# Altium schematic sheet DSO_Power.SchDoc: Schematic_Name
size A4; CompanyName: University of Melbourne; Engineer: Your Name Here; DocumentNumber: 1; Revision: 0.1; SheetNumber: 1; SheetTotal: 1; Title_Project: Project_Title; StudentNo: Student No.
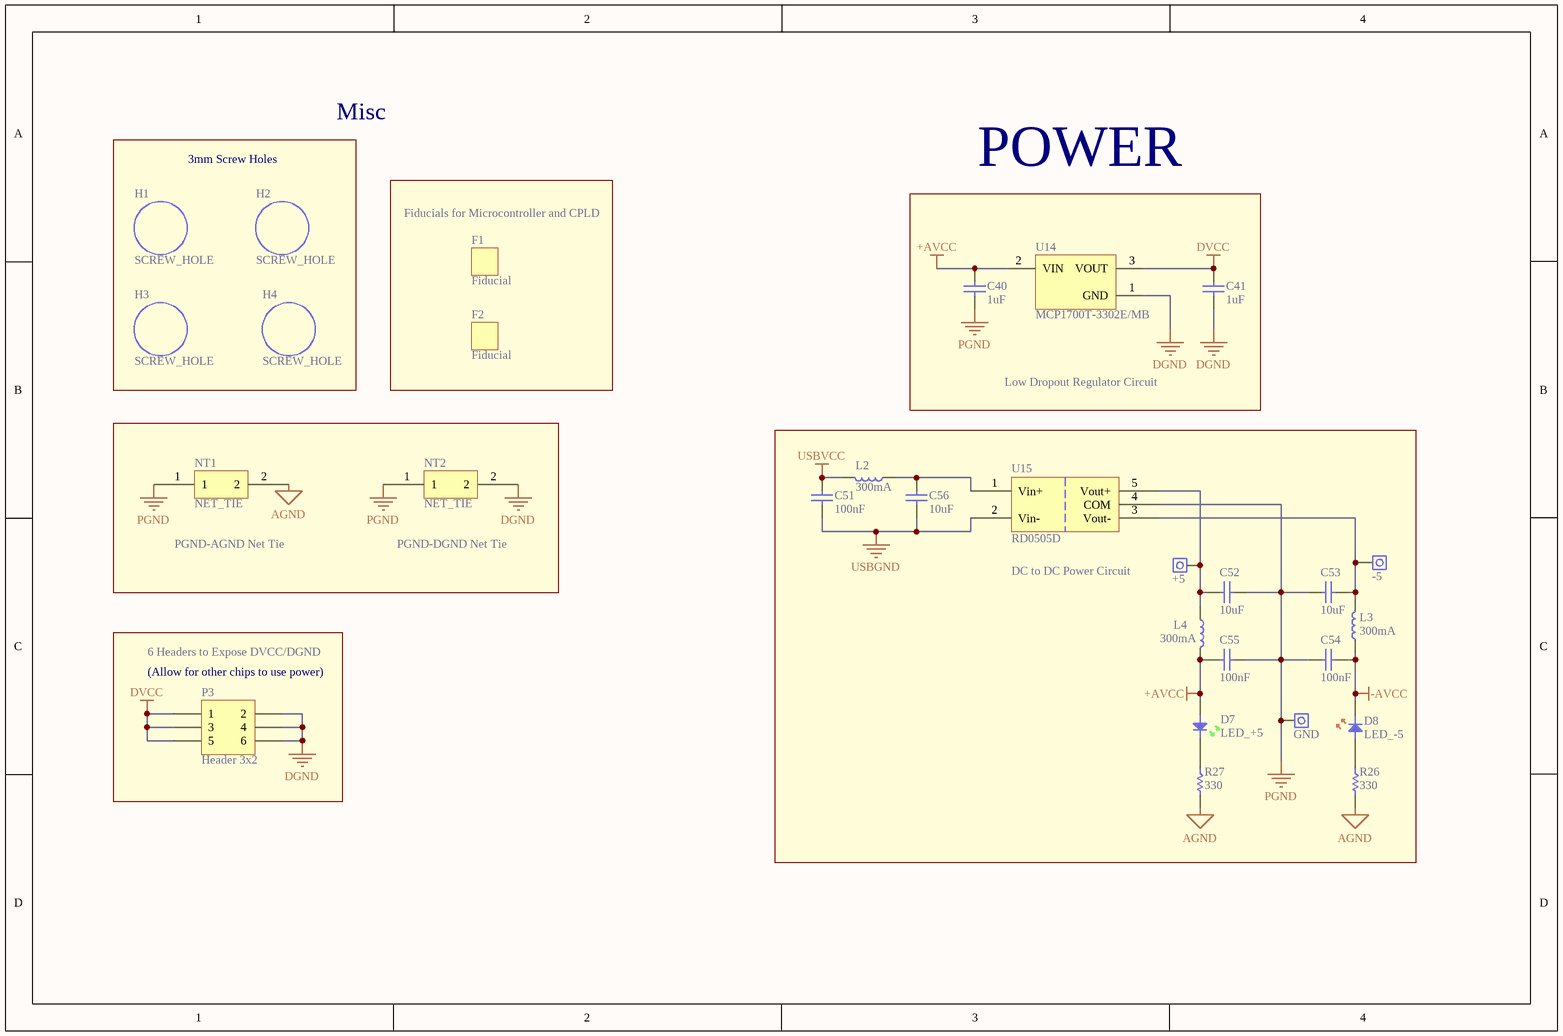
[diagram p0: DSO_Power.SchDoc]

## Parts
C40  1uF  [0805C]
C41  1uF  [0805C]
C51  100nF  [0805C]
C52  10uF  [0805C]
C53  10uF  [0805C]
C54  100nF  [0805C]
C55  100nF  [0805C]
C56  10uF  [0805C]
D7  LED_+5  [0805D-GREEN]
D8  LED_-5  [0805D-RED]
F1  Fiducial  [Fiducial]  (no BOM)
F2  Fiducial  [Fiducial]  (no BOM)
H1  SCREW_HOLE  [SCREW_HOLE]
H2  SCREW_HOLE  [SCREW_HOLE]
H3  SCREW_HOLE  [SCREW_HOLE]
H4  SCREW_HOLE  [SCREW_HOLE]
L2  300mA  [0805]
L3  300mA  [0805]
L4  300mA  [0805]
NT1  NET_TIE  [NET_TIE]  (net tie, no BOM)
NT2  NET_TIE  [NET_TIE]  (net tie, no BOM)
P3  Header 3x2  [HDR3x2]
R26  330  [0805]
R27  330  [0805]
TP9  -5  [PIN 1.8mm]
TP10  GND  [PIN 1.8mm]
TP11  +5  [PIN 1.8mm]
U14  MCP1700T-3302E/MB  [SOT89]
U15  RD0505D  [SIP_NMG]

## Blocks framed on the sheet
Misc: H1-H4
Fiducials for Microcontroller and CPLD: F1 F2
POWER: C40 C41 U14
DC to DC Power Circuit: C51-C56 D7 D8 L2-L4 R26 R27 TP9-TP11 U15

## Nets
+AVCC: C40.1 C55.1 D7.A L4.2 U14.2(VIN)
-AVCC: C54.1 D8.K L3.1
AGND: NT1.2 R26.2 R27.2
DGND: C41.2 NT2.2 P3.2 P3.4 P3.6 U14.1(GND)
DVCC: C41.1 P3.1 P3.3 P3.5 U14.3(VOUT)
PGND: C40.2 C52.2 C53.2 C54.2 C55.2 NT1.1 NT2.1 TP10.1 U15.4(COM)
USBGND: C51.2 C56.2 U15.2(Vin-)
USBVCC: C51.1 L2.2
NetC52_1: C52.1 L4.1 TP11.1 U15.5(Vout+)
NetC53_1: C53.1 L3.2 TP9.1 U15.3(Vout-)
NetC56_1: C56.1 L2.1 U15.1(Vin+)
NetD7_K: D7.K R27.1
NetD8_A: D8.A R26.1

## Notes on the sheet
- 3mm Screw Holes
- Low Dropout Regulator Circuit
- PGND-AGND Net Tie
- PGND-DGND Net Tie
- 6 Headers to Expose DVCC/DGND
- (near P3) (Allow for other chips to use power)

## Library data of the parts
C40 C41 C51-C56 = C: Capacitor; Reviewed by: RM - 2018/08/05; Revision: July-2002: Re-released for DXP Platform.; Supplier 1: *; Supplier Part Number 1: *
  C40 C41: Value: 1uF
  C51 C54 C55: Value: 100nF
  C52 C53 C56: Value: 10uF
D7 = LED GREEN: Light Emitting Diode; Reviewed by: RM - 2018/08/05; Revision: July-2002: Re-released for DXP Platform.; Supplier 1: Digi-Key; Supplier Part Number 1: 160-1423-1-ND
D8 = LED RED: Light Emitting Diode; Reviewed by: RM - 2018/08/05; Revision: July-2002: Re-released for DXP Platform.; Supplier 1: Digi-Key; Supplier Part Number 1: 475-1415-1-ND
L2-L4 = I: Inductor; Reviewed by: RM - 2018/08/05; Supplier 1: *; Supplier Part Number 1: *; Value: 300mA
NT1 NT2 = NET_TIE: Net Tie
P3 = Header 3x2: Header, 5-Pin; Reviewed by: RM - 2018/08/05; Supplier 1: Digi-Key; Supplier Part Number 1: 952-2121-ND
R26 R27 = R: Resistor; Reviewed by: RM - 2018/08/05; Supplier 1: *; Suppler Part Number 1: *; Value: 330
TP9-TP11 = WIRE: Pad
U14 = MCP1700T: Low Quiescent Current LDO, 3-Pin SOT-89, Extended Temperature, Tape and Reel; Reviewed by: RM - 2018/08/05; Supplier 1: Digi-Key; Supplier Part Number 1: MCP1700T3302EMBCT-ND
U15 = RD0505D: (ADV) DC to DC converter 5V in +-5V out; Reviewed by: RM - 2018/08/05; Supplier Part Number 1: 945-1136-ND; Supplier 1: Digi-Key